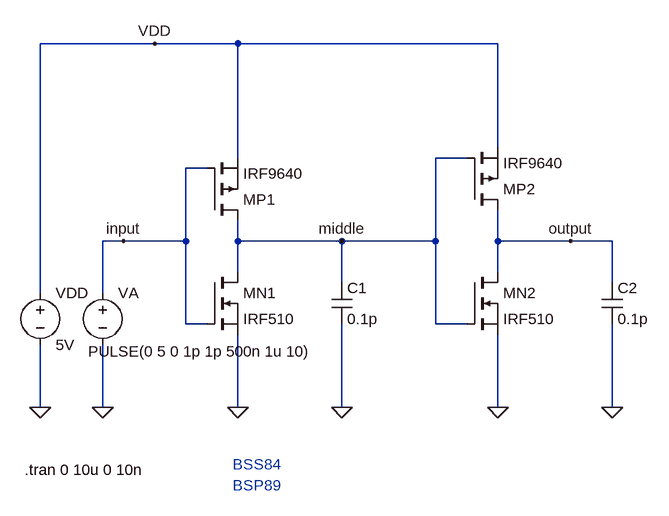
[diagram p0: schematic CMOS.asc]
CMOS.asc, the LTspice schematic file:
Version 4
SHEET 1 880 680
WIRE 96 -144 -80 -144
WIRE 224 -144 96 -144
WIRE 624 -144 224 -144
WIRE 624 16 624 -144
WIRE 224 32 224 -144
WIRE 576 32 528 32
WIRE 176 48 144 48
WIRE 48 160 16 160
WIRE 144 160 144 48
WIRE 144 160 48 160
WIRE 224 160 224 128
WIRE 384 160 224 160
WIRE 528 160 528 32
WIRE 528 160 384 160
WIRE 624 160 624 112
WIRE 736 160 624 160
WIRE 800 160 736 160
WIRE 224 208 224 160
WIRE 624 208 624 160
WIRE 384 224 384 160
WIRE 800 224 800 160
WIRE -80 240 -80 -144
WIRE 16 240 16 160
WIRE 144 288 144 160
WIRE 176 288 144 288
WIRE 528 288 528 160
WIRE 576 288 528 288
WIRE -80 416 -80 320
WIRE 16 416 16 320
WIRE 224 416 224 304
WIRE 384 416 384 288
WIRE 624 416 624 304
WIRE 800 416 800 288
FLAG -80 416 0
FLAG 16 416 0
FLAG 224 416 0
FLAG 384 416 0
FLAG 624 416 0
FLAG 800 416 0
FLAG 48 160 input
FLAG 736 160 output
FLAG 96 -144 VDD
FLAG 384 160 middle
SYMBOL voltage -80 224 R0
WINDOW 123 0 0 Left 0
WINDOW 39 0 0 Left 0
SYMATTR InstName VDD
SYMATTR Value 5V
SYMBOL voltage 16 224 R0
WINDOW 3 -22 106 Left 2
WINDOW 123 0 0 Left 0
WINDOW 39 0 0 Left 0
SYMATTR InstName VA
SYMATTR Value PULSE(0 5 0 1p 1p 500n 1u 10)
SYMBOL nmos 176 208 R0
SYMATTR InstName MN1
SYMATTR Value IRF510
SYMBOL cap 368 224 R0
SYMATTR InstName C1
SYMATTR Value 0.1p
SYMBOL cap 784 224 R0
SYMATTR InstName C2
SYMATTR Value 0.1p
SYMBOL nmos 576 208 R0
SYMATTR InstName MN2
SYMATTR Value IRF510
SYMBOL pmos 176 128 M180
SYMATTR InstName MP1
SYMATTR Value IRF9640
SYMBOL pmos 576 112 M180
SYMATTR InstName MP2
SYMATTR Value IRF9640
TEXT -104 512 Left 2 !.tran 0 10u 0 10n
TEXT 216 536 Left 2 ;BSP89
TEXT 216 504 Left 2 ;BSS84

The netlist it stands for:
* CMOS.asc
VDD VDD 0 5V
VA input 0 PULSE(0 5 0 1p 1p 500n 1u 10)
MN1 middle input 0 0 IRF510
C1 middle 0 0.1p
C2 output 0 0.1p
MN2 output middle 0 0 IRF510
MP1 middle input VDD VDD IRF9640
MP2 output middle VDD VDD IRF9640
.model NMOS NMOS
.model PMOS PMOS
.lib standard.mos
.tran 0 10u 0 10n
* BSP89
* BSS84
.backanno
.end